# Altium schematic sheet Mainboard_MCU_Breakout.SchDoc
size A4
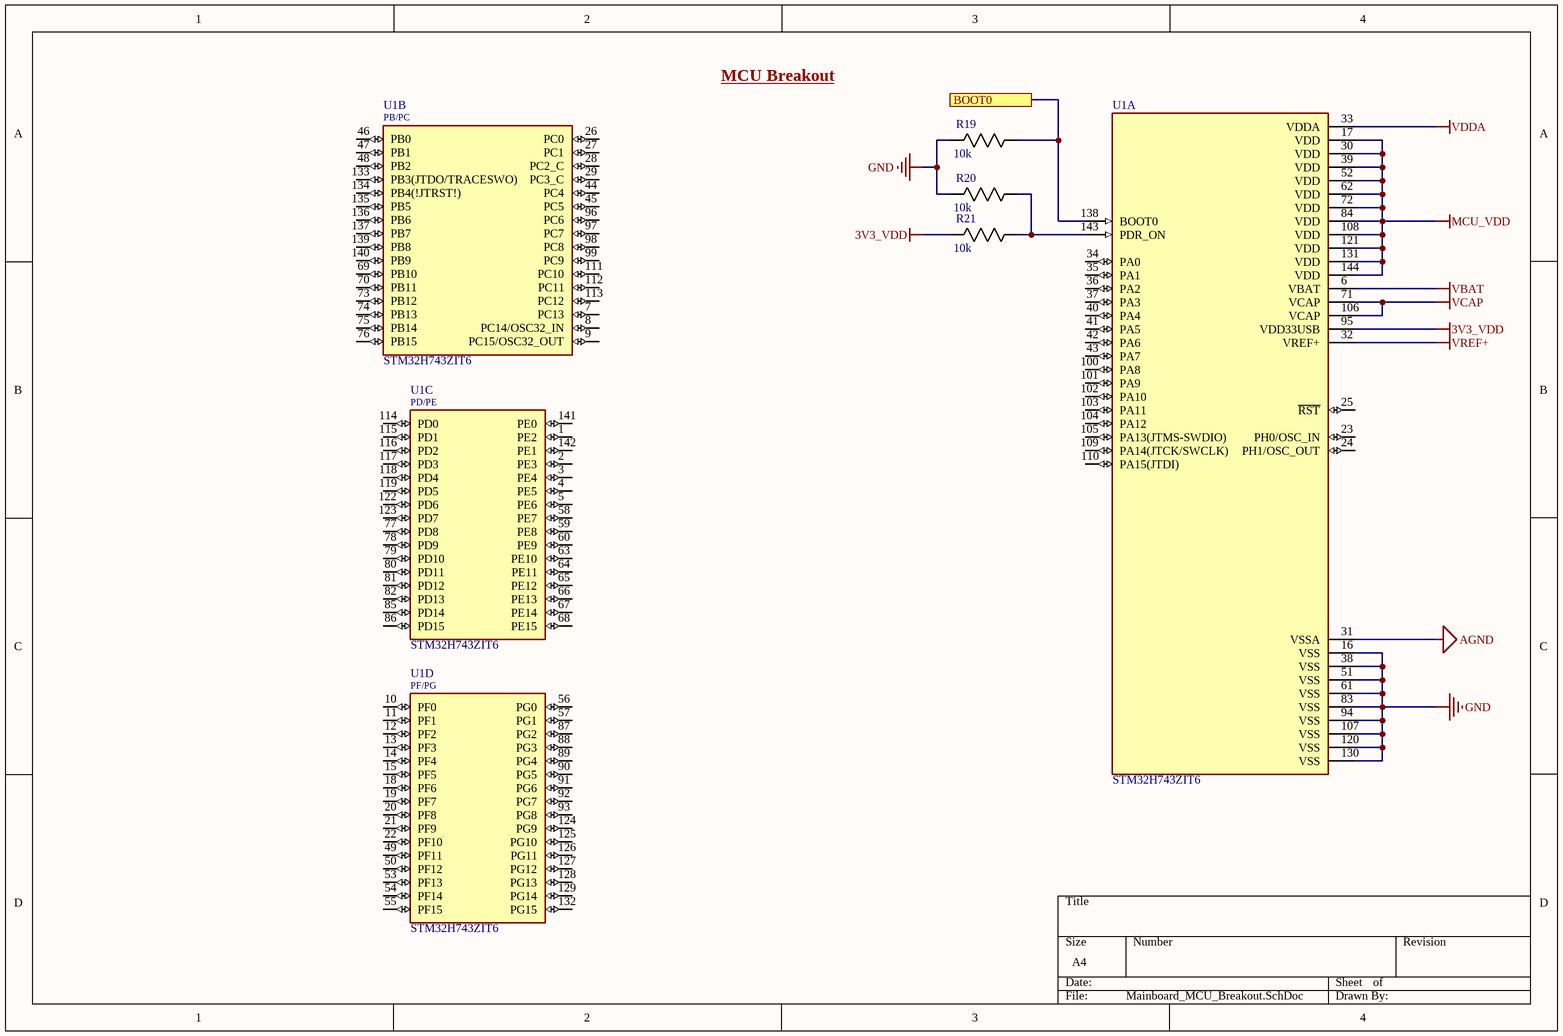
[diagram p0: Mainboard_MCU_Breakout.SchDoc]

## Parts
R19  10k  [0805]
R20  10k  [0805]
R21  10k  [0805]
U1  STM32H743ZIT6  [QFP50P2200X2200X160-144N]  (parts A,B,C,D of 4)

## Ports
BOOT0

## Nets
3V3_VDD: R21.2(R2) U1.95(VDD33USB)
AGND: U1.31(VSSA)
GND: R19.2(R2) R20.2(R2) U1.16(VSS) U1.38(VSS) U1.51(VSS) U1.61(VSS) U1.83(VSS) U1.94(VSS) U1.107(VSS) U1.120(VSS) U1.130(VSS)
MCU_VDD: U1.17(VDD) U1.30(VDD) U1.39(VDD) U1.52(VDD) U1.62(VDD) U1.72(VDD) U1.84(VDD) U1.108(VDD) U1.121(VDD) U1.131(VDD) U1.144(VDD)
VBAT: U1.6(VBAT)
VCAP: U1.71(VCAP) U1.106(VCAP)
VDDA: U1.33(VDDA)
VREF+: U1.32(VREF+)
BOOT0: R19.1(R1) U1.138(BOOT0) ; port BOOT0
NetR20_1: R20.1(R1) R21.1(R1) U1.143(PDR_ON)

Not connected (* = marked no-connect by the designer): U1 1(PE2) 2(PE3) 3(PE4) 4(PE5) 5(PE6) 7(PC13) 8(PC14/OSC32_IN) 9(PC15/OSC32_OUT) 10(PF0) 11(PF1) 12(PF2) 13(PF3) 14(PF4) 15(PF5) 18(PF6) 19(PF7) 20(PF8) 21(PF9) 22(PF10) 23(PH0/OSC_IN) 24(PH1/OSC_OUT) 25(~{RST}) 26(PC0) 27(PC1) 28(PC2_C) 29(PC3_C) 34(PA0) 35(PA1) 36(PA2) 37(PA3) 40(PA4) 41(PA5) 42(PA6) 43(PA7) 44(PC4) 45(PC5) 46(PB0) 47(PB1) 48(PB2) 49(PF11) 50(PF12) 53(PF13) 54(PF14) 55(PF15) 56(PG0) 57(PG1) 58(PE7) 59(PE8) 60(PE9) 63(PE10) 64(PE11) 65(PE12) 66(PE13) 67(PE14) 68(PE15) 69(PB10) 70(PB11) 73(PB12) 74(PB13) 75(PB14) 76(PB15) 77(PD8) 78(PD9) 79(PD10) 80(PD11) 81(PD12) 82(PD13) 85(PD14) 86(PD15) 87(PG2) 88(PG3) 89(PG4) 90(PG5) 91(PG6) 92(PG7) 93(PG8) 96(PC6) 97(PC7) 98(PC8) 99(PC9) 100(PA8) 101(PA9) 102(PA10) 103(PA11) 104(PA12) 105(PA13(JTMS-SWDIO)) 109(PA14(JTCK/SWCLK)) 110(PA15(JTDI)) 111(PC10) 112(PC11) 113(PC12) 114(PD0) 115(PD1) 116(PD2) 117(PD3) 118(PD4) 119(PD5) 122(PD6) 123(PD7) 124(PG9) 125(PG10) 126(PG11) 127(PG12) 128(PG13) 129(PG14) 132(PG15) 133(PB3(JTDO/TRACESWO)) 134(PB4(!JTRST!)) 135(PB5) 136(PB6) 137(PB7) 139(PB8) 140(PB9) 141(PE0) 142(PE1)

## Notes on the sheet
- MCU Breakout
- (in symbol STM32H743ZIT6, part B) PB/PC
- (in symbol STM32H743ZIT6, part C) PD/PE
- (in symbol STM32H743ZIT6, part D) PF/PG

## Library data of the parts
R19-R21 = RES 10k 1/8W - 1%: RES SMD 10K OHM 1% 1/8W 0805; Power (Watts): 0.125W; Package: 0805; Value: 10k; Tolerance: 1%
U1 = STM32H743ZIT6: ARM® Cortex®-M7 STM32H7 Microcontroller IC 32-Bit 480MHz 2MB (2M x 8) FLASH 144-LQFP (20x20); MF: STMicroelectronics; Package: LQFP-144 STMicroelectronics; MP: STM32H743ZIT6; ComponentLink1Description: SnapEDA; ComponentLink1URL: https://www.snapeda.com/parts/STM32H743ZIT6/STMicroelectronics/view-part/1041111/?ref=snap; ComponentLink2Description: DigiKey; ComponentLink2URL: https://www.digikey.ca/en/products/detail/stmicroelectronics/STM32H743ZIT6/7809238; ComponentLink3Description: Datasheet; ComponentLink3URL: https://www.st.com/resource/en/datasheet/stm32h743bi.pdf; DigiKey PN: 497-17721-ND